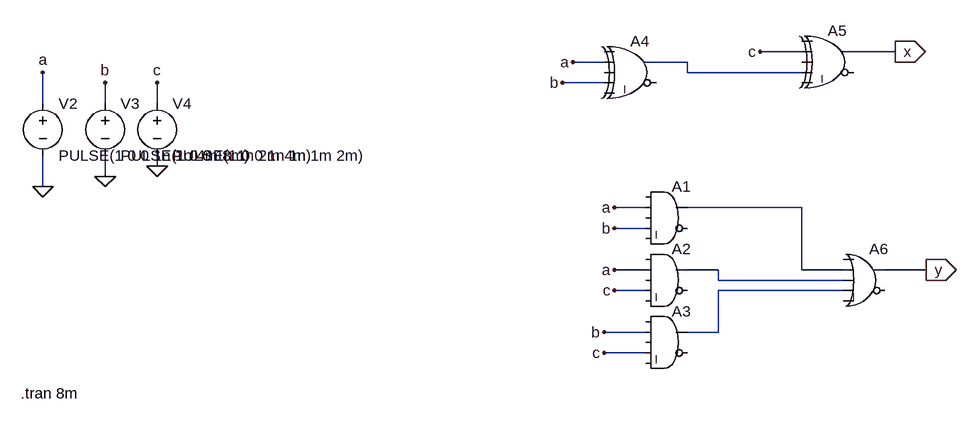
[diagram p0: schematic lab2.asc]
lab2.asc, the LTspice schematic file:
Version 4
SHEET 1 1016 680
WIRE 752 -32 688 -32
WIRE 896 -32 816 -32
WIRE 448 -16 400 -16
WIRE 576 -16 512 -16
WIRE 576 0 576 -16
WIRE 752 0 576 0
WIRE 448 16 384 16
WIRE -416 48 -416 0
WIRE -320 48 -320 16
WIRE -240 48 -240 16
WIRE -240 144 -240 128
WIRE -320 160 -320 128
WIRE -416 176 -416 128
WIRE 512 208 464 208
WIRE 752 208 576 208
WIRE 512 240 464 240
WIRE 512 304 464 304
WIRE 624 304 576 304
WIRE 752 304 752 208
WIRE 816 304 752 304
WIRE 944 304 880 304
WIRE 624 320 624 304
WIRE 816 320 624 320
WIRE 512 336 464 336
WIRE 816 336 624 336
WIRE 512 400 448 400
WIRE 624 400 624 336
WIRE 624 400 576 400
WIRE 512 432 448 432
FLAG -240 144 0
FLAG -320 160 0
FLAG -416 176 0
FLAG -416 0 a
FLAG -320 16 b
FLAG -240 16 c
FLAG 400 -16 a
FLAG 384 16 b
FLAG 688 -32 c
FLAG 464 208 a
FLAG 464 240 b
FLAG 464 304 a
FLAG 464 336 c
FLAG 448 400 b
FLAG 448 432 c
FLAG 896 -32 x
IOPIN 896 -32 Out
FLAG 944 304 y
IOPIN 944 304 Out
SYMBOL voltage -416 32 R0
WINDOW 123 0 0 Left 0
WINDOW 39 0 0 Left 0
SYMATTR InstName V2
SYMATTR Value PULSE(1 0 0 1n 1n 4m 8m)
SYMBOL voltage -320 32 R0
WINDOW 123 0 0 Left 0
WINDOW 39 0 0 Left 0
SYMATTR InstName V3
SYMATTR Value PULSE(1 0 0 1n 1n 2m 4m)
SYMBOL voltage -240 32 R0
WINDOW 123 0 0 Left 0
WINDOW 39 0 0 Left 0
SYMATTR InstName V4
SYMATTR Value PULSE(1 0 0 1n 1n 1m 2m)
SYMBOL Digital\\and 544 160 R0
SYMATTR InstName A1
SYMBOL Digital\\and 544 256 R0
SYMATTR InstName A2
SYMBOL Digital\\and 544 352 R0
SYMATTR InstName A3
SYMBOL Digital\\xor 496 -64 R0
SYMATTR InstName A4
SYMBOL Digital\\xor 800 -80 R0
SYMATTR InstName A5
SYMBOL Digital\\or 848 256 R0
SYMATTR InstName A6
TEXT -450 494 Left 2 !.tran 8m

The netlist it stands for:
* lab2.asc
V2 a 0 PULSE(1 0 0 1n 1n 4m 8m)
V3 b 0 PULSE(1 0 0 1n 1n 2m 4m)
V4 c 0 PULSE(1 0 0 1n 1n 1m 2m)
A1 0 a 0 b 0 0 N002 0 AND
A2 0 a 0 c 0 0 N003 0 AND
A3 0 b 0 c 0 0 N004 0 AND
A4 0 a 0 b 0 0 N001 0 XOR
A5 0 c 0 N001 0 0 x 0 XOR
A6 0 N002 N003 N004 0 0 y 0 OR
.tran 8m
.backanno
.end